# EAGLE design touch_pot (EAGLE 6.5.0)
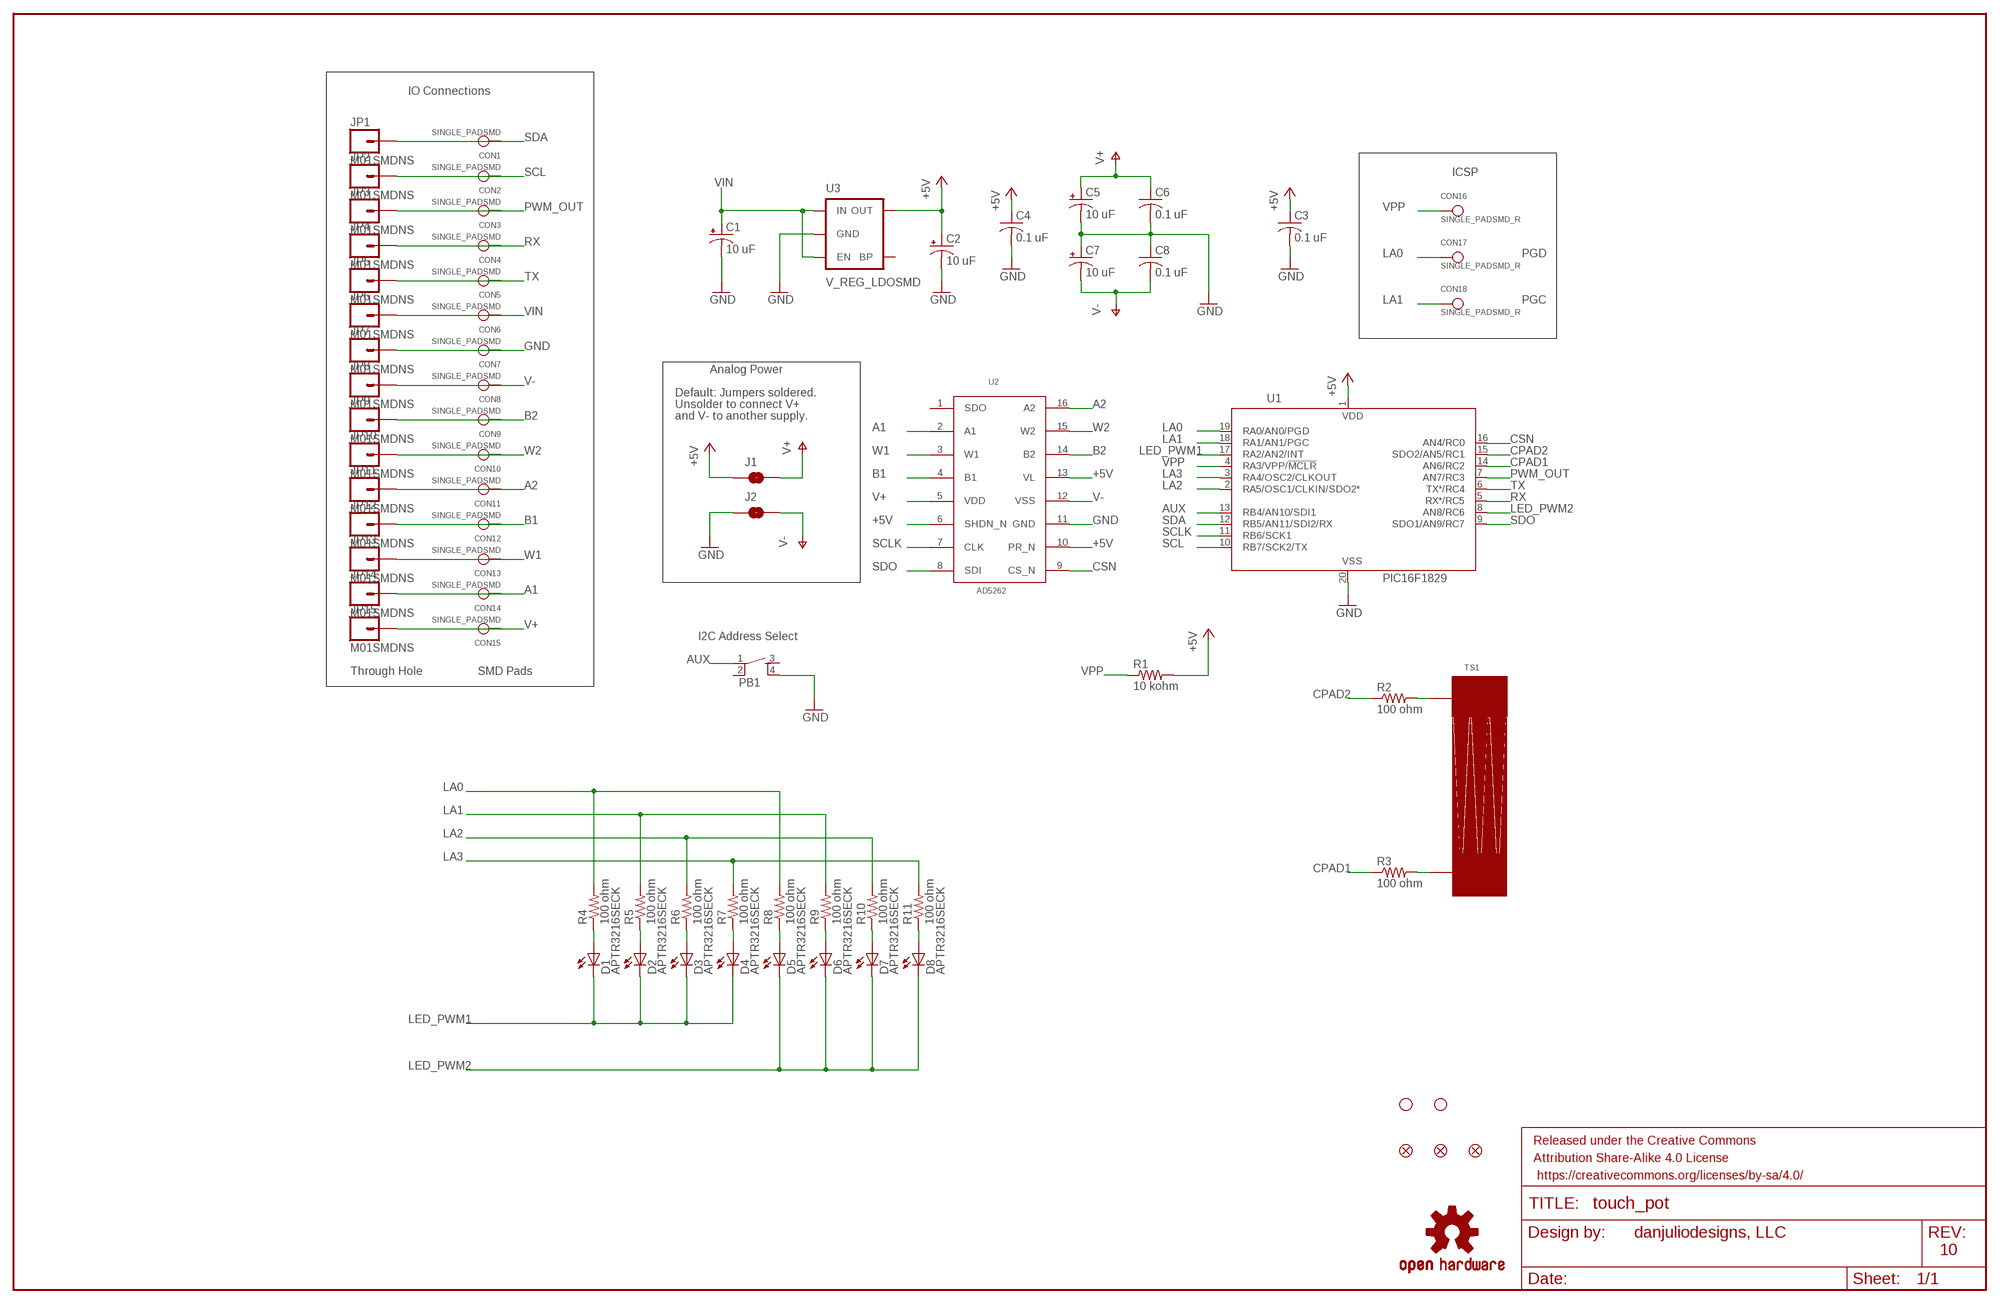
[diagram p0: schematic, sheet 1]

## Parts
C1  10 uF  CAP_POL1206  [EIA3216]
C2  10 uF  CAP_POL1206  [EIA3216]
C3  0.1 uF  C-USSMT0603  [C0603]
C4  0.1 uF  C-USSMT0603  [C0603]
C5  10 uF  CAP_POL1206  [EIA3216]
C6  0.1 uF  C-USSMT0603  [C0603]
C7  10 uF  CAP_POL1206  [EIA3216]
C8  0.1 uF  C-USSMT0603  [C0603]
CON1  SINGLE_PADSMD  [2MM_SMD_PAD]
CON2  SINGLE_PADSMD  [2MM_SMD_PAD]
CON3  SINGLE_PADSMD  [2MM_SMD_PAD]
CON4  SINGLE_PADSMD  [2MM_SMD_PAD]
CON5  SINGLE_PADSMD  [2MM_SMD_PAD]
CON6  SINGLE_PADSMD  [2MM_SMD_PAD]
CON7  SINGLE_PADSMD  [2MM_SMD_PAD]
CON8  SINGLE_PADSMD  [2MM_SMD_PAD]
CON9  SINGLE_PADSMD  [2MM_SMD_PAD]
CON10  SINGLE_PADSMD  [2MM_SMD_PAD]
CON11  SINGLE_PADSMD  [2MM_SMD_PAD]
CON12  SINGLE_PADSMD  [2MM_SMD_PAD]
CON13  SINGLE_PADSMD  [2MM_SMD_PAD]
CON14  SINGLE_PADSMD  [2MM_SMD_PAD]
CON15  SINGLE_PADSMD  [2MM_SMD_PAD]
CON16  SINGLE_PADSMD_R  [2MM_R_SMD_PAD]
CON17  SINGLE_PADSMD_R  [2MM_R_SMD_PAD]
CON18  SINGLE_PADSMD_R  [2MM_R_SMD_PAD]
D1  APTR3216SECK  LEDREV_32_16  [REV_LED_32_16]
D2  APTR3216SECK  LEDREV_32_16  [REV_LED_32_16]
D3  APTR3216SECK  LEDREV_32_16  [REV_LED_32_16]
D4  APTR3216SECK  LEDREV_32_16  [REV_LED_32_16]
D5  APTR3216SECK  LEDREV_32_16  [REV_LED_32_16]
D6  APTR3216SECK  LEDREV_32_16  [REV_LED_32_16]
D7  APTR3216SECK  LEDREV_32_16  [REV_LED_32_16]
D8  APTR3216SECK  LEDREV_32_16  [REV_LED_32_16]
FRAME3  FRAME-LEDGER  [CREATIVE_COMMONS]
J1  SJCLOSED  [SJ_2S]
J2  SJCLOSED  [SJ_2S]
JP1  M01SMDNS  [1X01NS]
JP2  M01SMDNS  [1X01NS]
JP3  M01SMDNS  [1X01NS]
JP4  M01SMDNS  [1X01NS]
JP5  M01SMDNS  [1X01NS]
JP6  M01SMDNS  [1X01NS]
JP7  M01SMDNS  [1X01NS]
JP8  M01SMDNS  [1X01NS]
JP9  M01SMDNS  [1X01NS]
JP10  M01SMDNS  [1X01NS]
JP11  M01SMDNS  [1X01NS]
JP12  M01SMDNS  [1X01NS]
JP13  M01SMDNS  [1X01NS]
JP14  M01SMDNS  [1X01NS]
JP15  M01SMDNS  [1X01NS]
PB1  PB_TACT_4SMT  [TACT_KPT_1187B]
R1  10 kohm  R-USSMT0603  [R0603]
R2  100 ohm  R-USSMT0603  [R0603]
R3  100 ohm  R-USSMT0603  [R0603]
R4  100 ohm  R-USSMT0603  [R0603]
R5  100 ohm  R-USSMT0603  [R0603]
R6  100 ohm  R-USSMT0603  [R0603]
R7  100 ohm  R-USSMT0603  [R0603]
R8  100 ohm  R-USSMT0603  [R0603]
R9  100 ohm  R-USSMT0603  [R0603]
R10  100 ohm  R-USSMT0603  [R0603]
R11  100 ohm  R-USSMT0603  [R0603]
STANDOFF1  STAND-OFFTIGHT  [STAND-OFF-TIGHT]
STANDOFF2  STAND-OFFTIGHT  [STAND-OFF-TIGHT]
TS1  2CH_LINEAR_TOUCH  [2CH_48MM_LINEAR_TOUCH]
U1  PIC16F1829  PIC16F1829SSOP20  [SSOP20]
U2  AD5262  AD6262TSSOP  [SSOP16]
U3  V_REG_LDOSMD  [SOT23-5]
U$1  FIDUCIAL  [FIDUCIAL]
U$2  FIDUCIAL  [FIDUCIAL]
U$3  FIDUCIAL  [FIDUCIAL]
U$4  OSHW-LOGOM  [OSHW-LOGO-M]

## Nets
+5V: C2.A(+) C3.1 C4.1 J1.1 R1.2 U1.1(VDD) U2.6(SHDN_N) U2.10(PR_N) U2.13(VL) U3.5(OUT)
A1: CON14.P$1 JP14.1 U2.2(A1)
A2: CON11.P$1 JP11.1 U2.16(A2)
AUX: PB1.1 U1.13(RB4/AN10/SDI1)
B1: CON12.P$1 JP12.1 U2.4(B1)
B2: CON9.P$1 JP9.1 U2.14(B2)
CPAD1: R3.1 U1.14(AN6/RC2)
CPAD2: R2.1 U1.15(SDO2/AN5/RC1)
CSN: U1.16(AN4/RC0) U2.9(CS_N)
GND: C1.C(-) C2.C(-) C3.2 C4.2 C5.C(-) C6.2 C7.A(+) C8.1 CON7.P$1 J2.1 JP7.1 PB1.4 U1.20(VSS) U2.11(GND) U3.2(GND)
LA0: CON17.P$1 R4.2 R8.2 U1.19(RA0/AN0/PGD)
LA1: CON18.P$1 R5.2 R9.2 U1.18(RA1/AN1/PGC)
LA2: R6.2 R10.2 U1.2(RA5/OSC1/CLKIN/SDO2*)
LA3: R7.2 R11.2 U1.3(RA4/OSC2/CLKOUT)
LED_PWM1: D1.C D2.C D3.C D4.C U1.17(RA2/AN2/INT)
LED_PWM2: D5.C D6.C D7.C D8.C U1.8(AN8/RC6)
N$1: D1.A R4.1
N$2: D2.A R5.1
N$3: D3.A R6.1
N$4: D4.A R7.1
N$5: D5.A R8.1
N$6: D6.A R9.1
N$7: D7.A R10.1
N$8: D8.A R11.1
N$37: R2.2 TS1.P$2
N$38: R3.2 TS1.P$1
PWM_OUT: CON3.P$1 JP3.1 U1.7(AN7/RC3)
RX: CON4.P$1 JP4.1 U1.5(RX*/RC5)
SCL: CON2.P$1 JP2.1 U1.10(RB7/SCK2/TX)
SCLK: U1.11(RB6/SCK1) U2.7(CLK)
SDA: CON1.P$1 JP1.1 U1.12(RB5/AN11/SDI2/RX)
SDO: U1.9(SDO1/AN9/RC7) U2.8(SDI)
TX: CON5.P$1 JP5.1 U1.6(TX*/RC4)
V+: C5.A(+) C6.1 CON15.P$1 J1.2 JP15.1 U2.5(VDD)
V-: C7.C(-) C8.2 CON8.P$1 J2.2 JP8.1 U2.12(VSS)
VIN: C1.A(+) CON6.P$1 JP6.1 U3.1(IN) U3.3(EN)
VPP: CON16.P$1 R1.1 U1.4(RA3/VPP/!MCLR)
W1: CON13.P$1 JP13.1 U2.3(W1)
W2: CON10.P$1 JP10.1 U2.15(W2)
Unconnected: PB1.2 PB1.3 U2.1(SDO) U3.4(BP)

## Notes on the sheet
- IO Connections
- ICSP
- PGD
- PGC
- Analog Power
- Default: Jumpers soldered.
- Unsolder to connect V+
- and V- to another supply.
- I2C Address Select
- Through Hole | SMD Pads
- danjuliodesigns, LLC
- 10

## Library data of the parts
C1 C2 C5 C7 = SparkFun:CAP_POL: Capacitor Polarized These are standard SMD and PTH capacitors. Normally 10uF, 47uF, and 100uF in electrolytic and tantalum varieties. Always verify the external diameter of the through hole cap, it varies with capacity, voltage, and manufacturer. The EIA devices should be standard.
C3 C4 C6 C8 = djd_eagle_library:C-US
CON1-CON18 = djd_eagle_library:SINGLE_PAD
D1-D8 = djd_eagle_library:LED
FRAME3 = SparkFun-Aesthetics:FRAME-LEDGER: Schematic Frame Standard 11x14 US Ledger frame
J1 J2 = djd_eagle_library:SJ: Solder jumper
JP1-JP15 = SparkFun:M01: Header 1 Standard 1-pin 0.1" header. Use with straight break away headers (SKU : PRT-00116), right angle break away headers (PRT-00553), swiss pins (PRT-00743), machine pins (PRT-00117), and female headers (PRT-00115).
PB1 = djd_eagle_library:PB_TACT_4: Common 4-pin Tact Button
R1-R11 = djd_eagle_library:R-US
STANDOFF1 STANDOFF2 = SparkFun-Electromechanical:STAND-OFF: #4 Stand Off This is the mechanical footprint for a #4 phillips button head screw. Use the keepout ring to avoid running the screw head into surrounding components. SKU : PRT-00447
TS1 = djd_eagle_library:2CH_LINEAR_TOUCH
U1 = djd_eagle_library:PIC16F1829
U2 = djd_eagle_library:AD6262: Analog Devices 2-channel 15V Digitial Potentiometer
U3 = SparkFun:V_REG_LDO: Voltage Regulator LDO Standard 150mA LDO voltage regulator in SOT-23 layout. Micrel part MIC5205. BP (by-pass) pin is used to lower output noise with 470pF cap.
U$1-U$3 = djd_eagle_library:FIDUCIAL
U$4 = SparkFun:OSHW-LOGO: Open Source Hardware Logo This logo indicates the piece of hardware it is found on incorporates a OSHW license and/or adheres to the definition of open source hardware found here: http://freedomdefined.org/OSHW

## Board
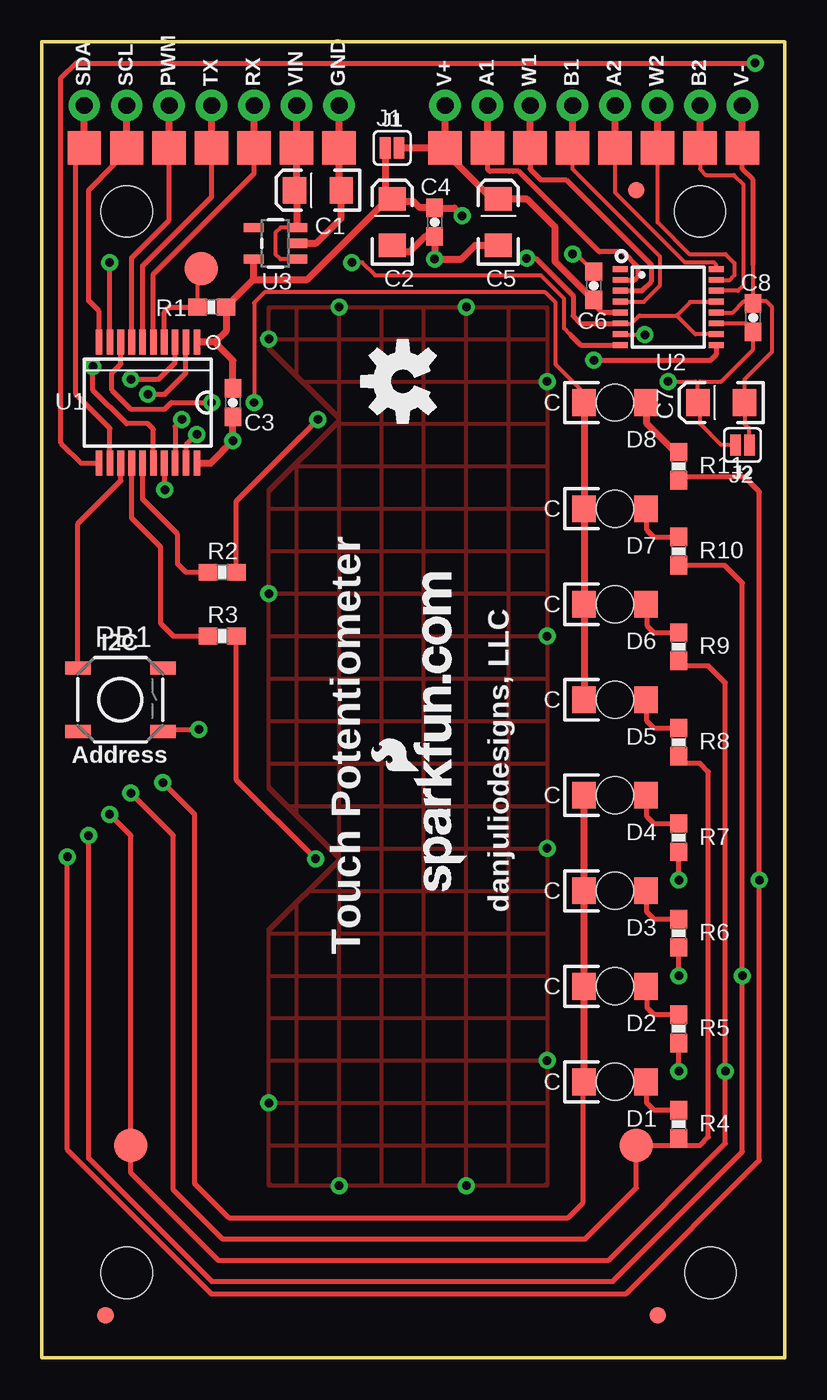
[diagram p1: board, top side]
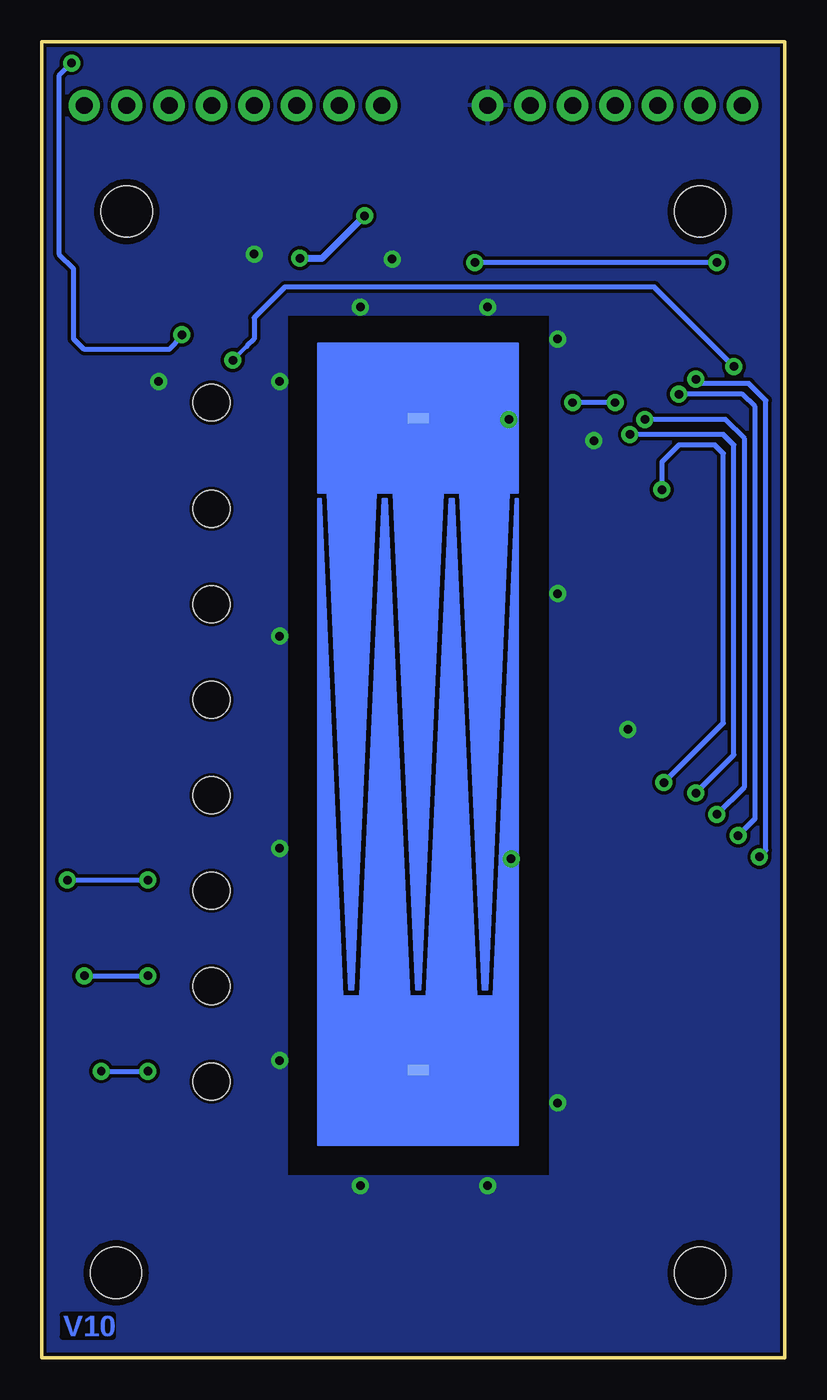
[diagram p2: board, bottom side, seen from below]

Size 44.45 x 78.74 mm. Coordinates in mm from the lower left corner, seen from the top.
Outline: 0,0 44.45,0 44.45,78.74 0,78.74 0,0
Copper layers (1*16): Top 0.035mm / dielectric 1.5mm / Bottom 0.035mm
Design rules "SparkFun-2-layer": minimum track width 7mil, minimum drill 15mil, track to track 8mil, track to pad 8mil, pad to pad 8mil, via to via 8mil, smd to smd 8mil, copper to edge 8mil, drill to drill 8mil, minimum pad ring 12mil, minimum via ring 10mil, stop-mask expansion 4mil, vias tented up to drill 20mil, thermal gap 10mil

### Footprints (pad centres in the part's own frame; a part is rotated, then mirrored left to right if it is on the bottom)
EIA3216 = smd 1.4 x 1.6: A 1.4,0; C -1.4,0
C0603 = smd 1.1 x 1: 1 -0.85,0; 2 0.85,0
2MM_SMD_PAD = smd 2 x 2: P$1 0,0
2MM_R_SMD_PAD = smd 2 x 2: P$1 0,0
REV_LED_32_16 = smd 1.4 x 1.6: A -1.85,0; C 1.85,0 | hole 2.2: 0,0
SJ_2S = smd 0.635 x 1.27: 1 -0.412,0; 2 0.412,0
1X01NS = drill 1.016 pad 1.88: 1 0,0
TACT_KPT_1187B = smd 1.524 x 0.762: 1 -2.54,1.905; 2 2.54,1.905; 3 -2.54,-1.905; 4 2.54,-1.905
R0603 = smd 1.1 x 1: 1 -0.85,0; 2 0.85,0
STAND-OFF-TIGHT = hole 3.048: 0,0
2CH_48MM_LINEAR_TOUCH = smd 1.27 x 0.635: P$1 6,4.5; P$2 6,43.5
SSOP20 = smd 0.4 x 1.5: 1 -2.925,-3.625; 2 -2.275,-3.625; 3 -1.625,-3.625; 4 -0.975,-3.625; 5 -0.325,-3.625; 6 0.325,-3.625; 7 0.975,-3.625; 8 1.625,-3.625; 9 2.275,-3.625; 10 2.925,-3.625; 11 2.925,3.625; 12 2.275,3.625; 13 1.625,3.625; 14 0.975,3.625; 15 0.325,3.625; 16 -0.325,3.625; 17 -0.975,3.625; 18 -1.625,3.625; 19 -2.275,3.625; 20 -2.925,3.625
SSOP16 = smd 0.9 x 0.35: 1 -2.875,2.275; 2 -2.875,1.625; 3 -2.875,0.975; 4 -2.875,0.325; 5 -2.875,-0.325; 6 -2.875,-0.975; 7 -2.875,-1.625; 8 -2.875,-2.275; 9 2.875,-2.275; 10 2.875,-1.625; 11 2.875,-0.975; 12 2.875,-0.325; 13 2.875,0.325; 14 2.875,0.975; 15 2.875,1.625; 16 2.875,2.275
SOT23-5 = smd 0.55 x 1.2: 1 -0.95,-1.3; 2 0,-1.3; 3 0.95,-1.3; 4 0.95,1.3; 5 -0.95,1.3
FIDUCIAL = smd 1 x 1: 1 0,0

### Placement (x,y rotation side)
C1  16.51,69.85 180 top
C2  20.95,67.94 90 top
C3  11.43,57.15 270 top
C4  23.5,67.94 270 top
C5  27.3,67.94 90 top
C6  33.02,64.14 90 top
C7  40.64,57.15 180 top
C8  42.55,62.23 90 top
CON1  2.54,72.39 0 top
CON2  5.08,72.39 0 top
CON3  7.62,72.39 0 top
CON4  12.7,72.39 0 top
CON5  10.16,72.39 0 top
CON6  15.24,72.39 0 top
CON7  17.78,72.39 0 top
CON8  41.91,72.39 0 top
CON9  39.37,72.39 0 top
CON10  36.83,72.39 0 top
CON11  34.29,72.39 0 top
CON12  31.75,72.39 0 top
CON13  29.21,72.39 0 top
CON14  26.67,72.39 0 top
CON15  24.13,72.39 0 top
CON16  9.53,65.15 90 top
CON17  35.56,12.7 0 top
CON18  5.33,12.7 0 top
D1  34.29,16.51 180 top
D2  34.29,22.23 180 top
D3  34.29,27.94 180 top
D4  34.29,33.66 180 top
D5  34.29,39.37 180 top
D6  34.29,45.09 180 top
D7  34.29,50.8 180 top
D8  34.29,57.15 180 top
FRAME3  21.59,-16.51 0 top  (outside the outline)
J1  20.95,72.39 0 top
J2  41.91,54.61 0 top
JP1  2.54,74.93 0 top
JP2  5.08,74.93 0 top
JP3  7.62,74.93 0 top
JP4  12.7,74.93 0 top
JP5  10.16,74.93 0 top
JP6  15.24,74.93 0 top
JP7  17.78,74.93 0 top
JP8  41.91,74.93 0 top
JP9  39.37,74.93 0 top
JP10  36.83,74.93 0 top
JP11  34.29,74.93 0 top
JP12  31.75,74.93 0 top
JP13  29.21,74.93 0 top
JP14  26.67,74.93 0 top
JP15  24.13,74.93 0 top
JP16  LOGO-SFENEW  [SFE-NEW-WEBLOGO]  25.4,27.94 90 top
PB1  4.7,39.37 0 top
R1  10.16,62.87 0 top
R2  10.79,46.99 0 top
R3  10.79,43.18 0 top
R4  38.1,13.97 270 top
R5  38.1,19.68 270 top
R6  38.1,25.4 270 top
R7  38.1,31.11 270 top
R8  38.1,36.83 270 top
R9  38.1,42.55 270 top
R10  38.1,48.26 270 top
R11  38.1,53.34 270 top
STANDOFF1  39.37,68.58 0 top
STANDOFF2  5.08,68.58 0 top
STANDOFF3  STAND-OFFTIGHT  [STAND-OFF-TIGHT]  5.08,5.08 0 top
STANDOFF4  STAND-OFFTIGHT  [STAND-OFF-TIGHT]  40.01,5.08 0 top
TS1  27.94,12.7 0 bottom
U1  6.35,57.15 180 top
U2  37.47,62.87 0 top
U3  13.97,66.67 90 top
U$1  36.83,2.54 0 top
U$2  35.56,69.85 0 top
U$3  3.81,2.54 0 top
U$4  21.59,58.42 90 top
U$5  FIDUCIAL  [FIDUCIAL]  1.27,-19.05 0 top  (outside the outline)

### Tracks (layer width: path | path; a pad name or v marks a point on that pad's centre or on a via)
+5V  (via drill 0.51)
  Top 0.254: v29.01,65.79 29.54,65.79 | U2.6 35.27,61.89 35.74,62.36 37.97,62.36 | U2.13 40.32,63.17 38.79,63.17 37.97,62.36 | U2.10 39.09,61.24 37.97,62.36 | 23.46,68.83 C4.1 | 11.05,62.8 11.01,62.84 R1.2
  Top 0.305: 29.54,65.79 31.77,63.55 31.77,62.33 32.22,61.89 U2.6
  Top 0.406: 10.35,60.77 11.43,59.69 C3.1 | 10.35,60.77 10.36,60.77 11.05,61.47 11.05,62.8 | 10.35,60.77 U1.1 | 12.67,64.53 U3.5 | R1.2 12.67,64.53 | 12.67,64.53 12.68,64.52 15.88,64.52 20.83,69.47 20.83,69.56 20.54,69.85 | 23.46,68.83 22.58,68.83 22.24,69.18 21.12,69.18 C2.A 20.54,69.76 20.54,69.85 | C4.1 24.68,68.8 v25.15,68.33 | J1.1 20.54,69.85
  Bottom 0.406: v25.15,68.33 27.69,65.79 v29.01,65.79
A1
  Top 0.305: U2.2 35.46,64.49 35.69,64.72 35.69,65.25 34.77,66.17 33.35,66.17 28.52,70.99 28.19,70.99 27.94,70.99 26.8,70.99 26.67,71.12 CON14.P$1
  Top 0.406: CON14.P$1 JP14.1
A2
  Top 0.254: U2.16 40.34,65.4 40.21,65.53 38.48,65.53 34.29,69.72 CON11.P$1
  Top 0.406: CON11.P$1 JP11.1
AUX
  Top 0.305: U1.13 4.72,52.48 2.16,49.91 PB1.1
B1
  Top 0.254: U2.4 36.01,63.19 36.96,64.14 36.96,65.91 31.75,71.12 CON12.P$1
  Top 0.406: CON12.P$1 JP12.1
B2
  Top 0.254: CON9.P$1 39.37,71.12 39.73,70.76 41.4,70.76 41.96,70.21 41.96,64.16 41.64,63.84 U2.14
  Top 0.406: CON9.P$1 JP9.1
CPAD1
  Top 0.305: R3.1 7.87,43.18 7.11,43.94 7.11,48.51 5.38,50.25 U1.14
CPAD2
  Top 0.305: U1.15 6.03,51.38 8.13,49.28 8.13,47.5 8.64,46.99 R2.1
CSN  (via drill 0.51)
  Top 0.305: U1.16 6.67,55.55 6.35,55.88 5.08,55.88 3.05,57.91 v3.05,59.31 | v33.02,59.69 40.01,59.69 40.34,60.02 U2.9
  Bottom 0.254: 32.18,60.53 v33.02,59.69
  Bottom 0.305: 32.18,60.53 31.75,60.96 31.75,62.23 29.91,64.07 7.81,64.07 v3.05,59.31
GND  (via drill 0.51)
  Top 0.254: U2.11 42.16,61.89 42.16,61.76 C8.1 42.55,60.33 40.64,58.42 39.37,58.42 39.24,58.29 | J2.1 40.64,54.61 39.37,55.88 39.37,57.02 C7.A 39.24,58.29 | v37.47,58.42 39.11,58.42 39.24,58.29 | 31.96,66.04 C6.2 | PB1.4 7.11,37.59 6.8,37.59
  Top 0.305: 6.8,37.59 v9.4,37.59
  Top 0.406: C3.2 v11.43,54.86 10.09,53.52 U1.20 | JP7.1 CON7.P$1 17.78,69.98 C1.C 17.91,68.2 16.38,66.67 U3.2 | v31.75,66.04 31.96,66.04 | C5.C 25.91,66.55 25.09,65.73 v23.5,65.73 C4.2 22.95,67.09 22.02,66.17 21.33,66.17 C2.C
  other vias: 17.78,10.29 25.4,10.29 17.78,62.87 25.4,62.87 13.59,60.96 13.59,45.72 13.59,15.24 30.23,17.78 30.23,30.48 30.23,43.18 30.23,58.42
  pour Bottom: 0,0 13.97,0 13.97,72.39 0,72.39
  pour Top (rank 3, hatched): 13.59,62.87 30.23,62.87 30.23,10.29 13.59,10.29 13.59,25.65 17.78,29.84 13.59,34.04 13.59,51.94 17.78,56.13 13.59,60.33
  pour Bottom: 29.84,0 44.45,0 44.45,73.66 29.84,73.66
  pour Bottom: 0,78.74 44.45,78.74 44.45,62.48 0,62.48
  pour Bottom: 0,10.79 44.45,10.79 44.45,0 0,0
LA0  (via drill 0.51)
  Top 0.254: 38.1,12.7 R4.2
  Top 0.305: U1.19 8.62,54.6 v9.27,55.24 | v5.33,33.78 7.87,31.24 7.87,10.03 10.79,7.11 32.51,7.11 35.56,10.16 CON17.P$1 37.68,12.7 R4.2 | 38.1,12.7 39.37,12.7 39.88,13.21 39.88,35.05 39.37,35.56 38.42,35.56 38.42,35.66 R8.2
  Bottom 0.305: v9.27,55.24 3.68,55.24 3.05,54.61 3.05,36.07 v5.33,33.78
LA1  (via drill 0.51)
  Top 0.305: U1.18 7.97,55.73 v8.38,56.13 | v38.1,17.14 R5.2 | v4.06,32.51 5.33,31.24 CON18.P$1 5.33,11.05 10.54,5.84 33.91,5.84 40.89,12.83 v40.89,17.14 40.89,40.39 39.88,41.4 38.29,41.4 38.29,41.5 R9.2
  Bottom 0.305: v8.38,56.13 3.56,56.13 2.41,54.99 2.41,34.16 v4.06,32.51 | v40.89,17.14 v38.1,17.14
LA2  (via drill 0.51)
  Top 0.305: U1.2 8.62,58.92 7.37,57.66 v6.35,57.66 | v2.79,31.24 2.79,11.94 10.16,4.57 34.16,4.57 41.91,12.32 v41.91,22.86 41.91,46.35 40.85,47.41 R10.2 | v38.1,22.86 R6.2
  Bottom 0.305: v2.79,31.24 1.78,32.26 1.78,56.9 2.54,57.66 v6.35,57.66 | v41.91,22.86 v38.1,22.86
LA3  (via drill 0.51)
  Top 0.305: U1.3 7.97,59.54 6.99,58.55 v5.33,58.55 | v38.1,28.57 R7.2 | R11.2 38.31,52.7 42.04,52.7 42.93,51.82 v42.93,28.57 42.93,11.81 34.92,3.81 10.16,3.81 1.52,12.45 v1.52,29.97
  Bottom 0.305: v5.33,58.55 5.08,58.29 2.16,58.29 1.14,57.28 1.14,30.35 v1.52,29.97 | v42.93,28.57 v38.1,28.57
LED_PWM1  (via drill 0.51)
  Top 0.305: v7.37,51.94 7.37,53.48 U1.17 | v7.24,34.42 9.14,32.51 9.14,10.41 11.18,8.38 31.5,8.38 32.38,9.27 32.38,16.45 D1.C
  Top 0.406: D4.C D3.C D2.C D1.C
  Bottom 0.305: v7.37,51.94 7.37,53.59 6.35,54.61 4.19,54.61 3.68,54.1 3.68,37.97 v7.24,34.42
LED_PWM2  (via drill 0.51)
  Top 0.254: 32.38,56.57 32.38,57.78 30.73,59.44 30.73,63.12 30.1,63.75 13.34,63.75 12.7,63.12 v12.7,57.15
  Top 0.305: U1.8 4.72,59.46 4.19,58.93 4.19,57.91 5.33,56.77 7.37,56.77 7.75,57.15 v10.16,57.15
  Top 0.406: D5.C D6.C D7.C D8.C 32.38,57.09 32.38,56.57
  Bottom 0.305: v10.16,57.15 v12.7,57.15
N$1
  Top 0.305: D1.A 36.2,16.45 36.2,15.24 36.62,14.82 R4.1
N$2
  Top 0.305: D2.A 36.2,22.17 36.2,20.95 36.62,20.54 R5.1
N$3
  Top 0.305: D3.A 36.2,27.89 36.2,26.67 36.62,26.25 R6.1
N$4
  Top 0.305: D4.A 36.2,33.6 36.2,32.38 36.62,31.96 R7.1
N$5
  Top 0.305: D5.A 36.2,39.31 36.2,38.1 36.62,37.68 R8.1
N$6
  Top 0.305: D6.A 36.2,45.03 36.2,43.81 36.62,43.4 R9.1
N$7
  Top 0.305: D7.A 36.2,50.74 36.2,49.53 36.62,49.11 R10.1
N$8
  Top 0.406: R11.1 37.88,54.19 36.2,55.88 36.2,57.09 D8.A
N$37  (via drill 0.51)
  Top 0.305: R2.2 11.64,51.27 v16.51,56.13
  Bottom 0.305: v16.51,56.13 21.87,56.13 TS1.P$2
N$38  (via drill 0.51)
  Top 0.305: R3.2 11.64,34.58 v16.38,29.84
  Bottom 0.254: 16.38,19.56 18.8,17.14 18.92,17.14
  Bottom 0.305: 16.38,19.56 v16.38,29.84 | 18.92,17.14 21.89,17.14 TS1.P$1
PWM_OUT
  Top 0.305: U1.7 5.38,65.83 7.62,68.07 CON3.P$1
  Top 0.406: CON3.P$1 JP3.1
RX
  Top 0.305: U1.5 6.67,64.84 12.7,70.87 CON4.P$1
  Top 0.406: CON4.P$1 JP4.1
SCL
  Top 0.305: U1.10 3.42,62.62 2.79,63.25 2.79,69.85 4.32,71.37 4.32,71.63 CON2.P$1
  Top 0.406: CON2.P$1 JP2.1
SCLK  (via drill 0.51)
  Top 0.254: U2.7 34.62,61.21 v36.07,61.21
  Top 0.305: U1.11 2.35,53.52 1.14,54.74 1.14,76.58 2.03,77.47 v42.67,77.47
  Bottom 0.305: v42.67,77.47 43.43,76.71 43.43,66.04 42.55,65.15 42.55,60.96 41.91,60.33 36.83,60.33 36.07,61.09 v36.07,61.21
SDA
  Top 0.305: U1.12 4.08,55.62 2.03,57.66 2.03,71.88 CON1.P$1
  Top 0.406: CON1.P$1 JP1.1
SDO  (via drill 0.51)
  Top 0.254: 31.61,61.23 31.24,61.59 31.24,63.37 29.84,64.77 19.94,64.77 19.18,65.53 v18.54,65.53
  Top 0.305: U1.9 4.08,65.52 v4.06,65.53 | 31.61,61.23 32.25,60.59 U2.8
  Bottom 0.305: v4.06,65.53 v18.54,65.53
TX
  Top 0.305: U1.6 6.03,65.33 10.16,69.47 CON5.P$1
  Top 0.406: CON5.P$1 JP5.1
V+
  Top 0.305: U2.5 33.53,62.53 32.78,63.28 C6.1
  Top 0.406: J1.2 CON15.P$1 | CON15.P$1 24.64,71.88 24.64,71.63 26.92,69.34 C5.A 29,69.34 30.71,67.64 30.71,65.6 C6.1 | CON15.P$1 JP15.1
  Top 0.61: CON15.P$1 23.5,71.75
V-
  Top 0.254: C8.2 42.55,65.41 | U2.12 41.33,62.54 42,63.21 42.42,63.21 | J2.2 42.32,55.59 42.04,55.88 C7.C 42.04,58.55 43.69,60.2 43.69,62.87 43.35,63.21 42.67,63.21
  Top 0.305: 42.42,63.21 C8.2 42.67,63.21 | 42.55,65.41 42.55,70.48 41.91,71.12 CON8.P$1
  Top 0.406: CON8.P$1 JP8.1
VIN
  Top 0.254: U3.3 14.29,67.62 13.97,67.31 13.97,66.04 14.29,65.72 U3.1
  Top 0.406: C1.A 15.24,69.98 CON6.P$1 JP6.1 | C1.A 15.56,69.4 | U3.3 15.27,69.69 C1.A
VPP
  Top 0.254: CON16.P$1 9.31,64.94 R1.1
  Top 0.305: U1.4 7.33,62.57 7.62,62.87 R1.1
W1
  Top 0.305: CON13.P$1 29.21,71.12 29.84,70.48 31.37,70.48 36.45,65.41 36.45,64.39 35.9,63.84 U2.3
  Top 0.406: CON13.P$1 JP13.1
W2
  Top 0.254: U2.15 41.15,64.49 41.43,64.77 41.43,65.51 40.89,66.04 38.73,66.04 36.83,67.94 CON10.P$1
  Top 0.305: U2.15
  Top 0.406: CON10.P$1 JP10.1

### Text on the board
Bottom: V10
tPlace: SDA | SCL | PWM | TX | RX | VIN | GND | V+ | A1 | W1 | B1 | A2 | W2 | B2 | V- | J1 | J2 | I2C | Address | danjuliodesigns, LLC | Touch Potentiometer
tDocu: danjuliodesigns, LLC